# Altium schematic sheet main.SchDoc
size A3
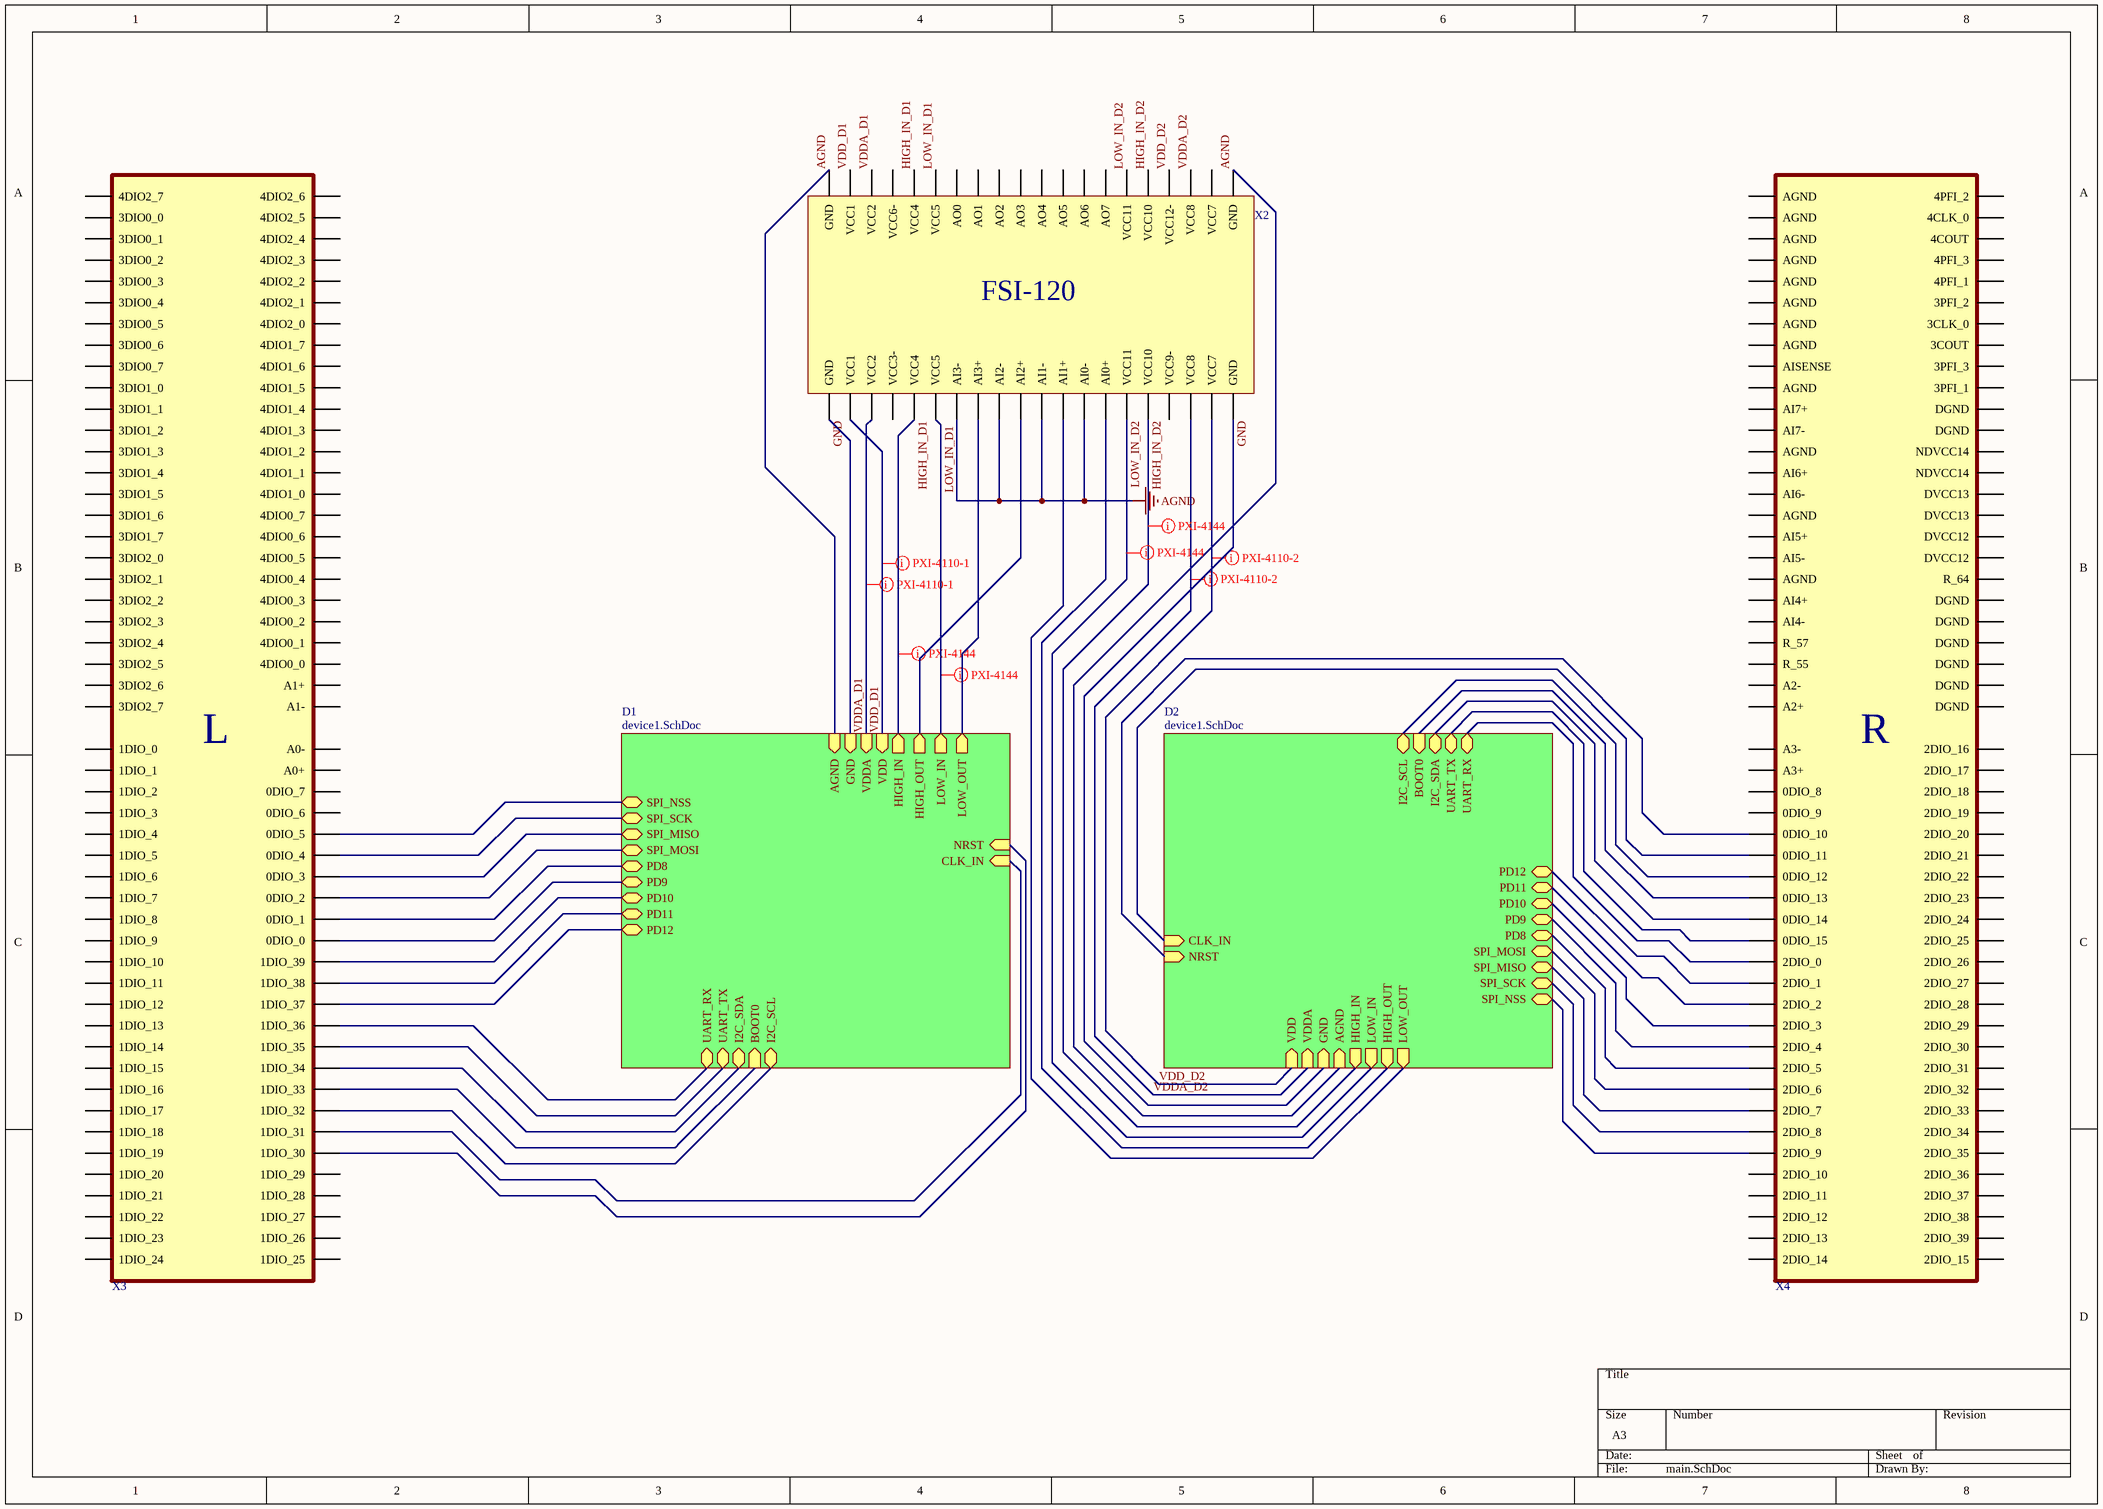
[diagram p0: main.SchDoc]

## Parts
X2  FSI120  [FSI-120]  (value not drawn)
X3  FSI-150-L  [FSI-150]  (value not drawn)
X4  FSI-150-R  [FSI-150]  (value not drawn)

## Sub-sheets
D1 = device1.SchDoc: AGND (in), GND (in), VDDA (in), VDD (in), SPI_NSS (bidir), SPI_SCK (bidir), SPI_MISO (bidir), SPI_MOSI (bidir), PD8 (bidir), PD9 (bidir), PD10 (bidir), PD11 (bidir), PD12 (bidir), UART_RX (bidir), UART_TX (bidir), I2C_SDA (bidir), BOOT0 (in), I2C_SCL (bidir), HIGH_IN (out), LOW_IN (out), NRST (in), CLK_IN (in), HIGH_OUT (out), LOW_OUT (out)
D2 = device1.SchDoc: AGND (in), GND (in), VDDA (in), VDD (in), SPI_NSS (bidir), SPI_SCK (bidir), SPI_MISO (bidir), SPI_MOSI (bidir), PD8 (bidir), PD9 (bidir), PD10 (bidir), PD11 (bidir), PD12 (bidir), UART_RX (bidir), UART_TX (bidir), I2C_SDA (bidir), BOOT0 (in), I2C_SCL (bidir), HIGH_IN (out), LOW_IN (out), NRST (in), CLK_IN (in), LOW_OUT (out), HIGH_OUT (out)

## Nets
AGND: X2.8(AI0-) X2.10(AI1-) X2.12(AI2-) X2.14(AI3-) X2.21(GND) X2.40(GND) ; sheet D1/AGND, sheet D2/AGND
GND: X2.1(GND) X2.20(GND) ; sheet D1/GND, sheet D2/GND
HIGH_IN_D1: X2.16(VCC4) X2.25(VCC4) ; sheet D1/HIGH_IN
HIGH_IN_D2: X2.5(VCC10) X2.36(VCC10) ; sheet D2/HIGH_IN
LOW_IN_D1: X2.15(VCC5) X2.26(VCC5) ; sheet D1/LOW_IN
LOW_IN_D2: X2.6(VCC11) X2.35(VCC11) ; sheet D2/LOW_IN
VDD_D1: X2.19(VCC1) X2.22(VCC1) ; sheet D1/VDD
VDD_D2: X2.2(VCC7) X2.39(VCC12-) ; sheet D2/VDD
VDDA_D1: X2.18(VCC2) X2.23(VCC2) ; sheet D1/VDDA
VDDA_D2: X2.3(VCC8) X2.38(VCC8) ; sheet D2/VDDA
NetX2_7: X2.7(AI0+) ; sheet D2/HIGH_OUT
NetX2_9: X2.9(AI1+) ; sheet D2/LOW_OUT
NetX2_11: X2.11(AI2+) ; sheet D1/HIGH_OUT
NetX2_13: X2.13(AI3+) ; sheet D1/LOW_OUT
NetX3_R_12: X3.R_12(1DIO_30) ; sheet D1/NRST
NetX3_R_14: X3.R_14(1DIO_31) ; sheet D1/CLK_IN
NetX3_R_16: X3.R_16(1DIO_32) ; sheet D1/I2C_SCL
NetX3_R_18: X3.R_18(1DIO_33) ; sheet D1/BOOT0
NetX3_R_20: X3.R_20(1DIO_34) ; sheet D1/I2C_SDA
NetX3_R_22: X3.R_22(1DIO_35) ; sheet D1/UART_TX
NetX3_R_24: X3.R_24(1DIO_36) ; sheet D1/UART_RX
NetX3_R_26: X3.R_26(1DIO_37) ; sheet D1/PD12
NetX3_R_28: X3.R_28(1DIO_38) ; sheet D1/PD11
NetX3_R_30: X3.R_30(1DIO_39) ; sheet D1/PD10
NetX3_R_32: X3.R_32(0DIO_0) ; sheet D1/PD9
NetX3_R_34: X3.R_34(0DIO_1) ; sheet D1/PD8
NetX3_R_36: X3.R_36(0DIO_2) ; sheet D1/SPI_MOSI
NetX3_R_38: X3.R_38(0DIO_3) ; sheet D1/SPI_MISO
NetX3_R_40: X3.R_40(0DIO_4) ; sheet D1/SPI_SCK
NetX3_R_42: X3.R_42(0DIO_5) ; sheet D1/SPI_NSS
NetX4_R_11: X4.R_11(2DIO_9) ; sheet D2/SPI_NSS
NetX4_R_13: X4.R_13(2DIO_8) ; sheet D2/SPI_SCK
NetX4_R_15: X4.R_15(2DIO_7) ; sheet D2/SPI_MISO
NetX4_R_17: X4.R_17(2DIO_6) ; sheet D2/SPI_MOSI
NetX4_R_19: X4.R_19(2DIO_5) ; sheet D2/PD8
NetX4_R_21: X4.R_21(2DIO_4) ; sheet D2/PD9
NetX4_R_23: X4.R_23(2DIO_3) ; sheet D2/PD10
NetX4_R_25: X4.R_25(2DIO_2) ; sheet D2/PD11
NetX4_R_27: X4.R_27(2DIO_1) ; sheet D2/PD12
NetX4_R_29: X4.R_29(2DIO_0) ; sheet D2/UART_RX
NetX4_R_31: X4.R_31(0DIO_15) ; sheet D2/UART_TX
NetX4_R_33: X4.R_33(0DIO_14) ; sheet D2/I2C_SDA
NetX4_R_35: X4.R_35(0DIO_13) ; sheet D2/BOOT0
NetX4_R_37: X4.R_37(0DIO_12) ; sheet D2/I2C_SCL
NetX4_R_39: X4.R_39(0DIO_11) ; sheet D2/CLK_IN
NetX4_R_41: X4.R_41(0DIO_10) ; sheet D2/NRST

Not connected (* = marked no-connect by the designer): X2 4(VCC9-) 17(VCC3-) 24(VCC6-) 27(AO0) 28(AO1) 29(AO2) 30(AO3) 31(AO4) 32(AO5) 33(AO6) 34(AO7) 37(VCC7); X3 R_1(1DIO_24) R_2(1DIO_25) R_3(1DIO_23) R_4(1DIO_26) R_5(1DIO_22) R_6(1DIO_27) R_7(1DIO_21) R_8(1DIO_28) R_9(1DIO_20) R_10(1DIO_29) R_11(1DIO_19) R_13(1DIO_18) R_15(1DIO_17) R_17(1DIO_16) R_19(1DIO_15) R_21(1DIO_14) R_23(1DIO_13) R_25(1DIO_12) R_27(1DIO_11) R_29(1DIO_10) R_31(1DIO_9) R_33(1DIO_8) R_35(1DIO_7) R_37(1DIO_6) R_39(1DIO_5) R_41(1DIO_4) R_43(1DIO_3) R_44(0DIO_6) R_45(1DIO_2) R_46(0DIO_7) R_47(1DIO_1) R_48(A0+) R_49(1DIO_0) R_50(A0-) R_51(3DIO2_7) R_52(A1-) R_53(3DIO2_6) R_54(A1+) R_55(3DIO2_5) R_56(4DIO0_0) R_57(3DIO2_4) R_58(4DIO0_1) R_59(3DIO2_3) R_60(4DIO0_2) R_61(3DIO2_2) R_62(4DIO0_3) R_63(3DIO2_1) R_64(4DIO0_4) R_65(3DIO2_0) R_66(4DIO0_5) R_67(3DIO1_7) R_68(4DIO0_6) R_69(3DIO1_6) R_70(4DIO0_7) R_71(3DIO1_5) R_72(4DIO1_0) R_73(3DIO1_4) R_74(4DIO1_1) R_75(3DIO1_3) R_76(4DIO1_2) R_77(3DIO1_2) R_78(4DIO1_3) R_79(3DIO1_1) R_80(4DIO1_4) R_81(3DIO1_0) R_82(4DIO1_5) R_83(3DIO0_7) R_84(4DIO1_6) R_85(3DIO0_6) R_86(4DIO1_7) R_87(3DIO0_5) R_88(4DIO2_0) R_89(3DIO0_4) R_90(4DIO2_1) R_91(3DIO0_3) R_92(4DIO2_2) R_93(3DIO0_2) R_94(4DIO2_3) R_95(3DIO0_1) R_96(4DIO2_4) R_97(3DIO0_0) R_98(4DIO2_5) R_99(4DIO2_7) R_100(4DIO2_6); X4 R_1(2DIO_14) R_2(2DIO_15) R_3(2DIO_13) R_4(2DIO_39) R_5(2DIO_12) R_6(2DIO_38) R_7(2DIO_11) R_8(2DIO_37) R_9(2DIO_10) R_10(2DIO_36) R_12(2DIO_35) R_14(2DIO_34) R_16(2DIO_33) R_18(2DIO_32) R_20(2DIO_31) R_22(2DIO_30) R_24(2DIO_29) R_26(2DIO_28) R_28(2DIO_27) R_30(2DIO_26) R_32(2DIO_25) R_34(2DIO_24) R_36(2DIO_23) R_38(2DIO_22) R_40(2DIO_21) R_42(2DIO_20) R_43(0DIO_9) R_44(2DIO_19) R_45(0DIO_8) R_46(2DIO_18) R_47(A3+) R_48(2DIO_17) R_49(A3-) R_50(2DIO_16) R_51(A2+) R_52(DGND) R_53(A2-) R_54(DGND) R_55 R_56(DGND) R_57 R_58(DGND) R_59(AI4-) R_60(DGND) R_61(AI4+) R_62(DGND) R_63(AGND) R_64 R_65(AI5-) R_66(DVCC12) R_67(AI5+) R_68(DVCC12) R_69(AGND) R_70(DVCC13) R_71(AI6-) R_72(DVCC13) R_73(AI6+) R_74(NDVCC14) R_75(AGND) R_76(NDVCC14) R_77(AI7-) R_78(DGND) R_79(AI7+) R_80(DGND) R_81(AGND) R_82(3PFI_1) R_83(AISENSE) R_84(3PFI_3) R_85(AGND) R_86(3COUT) R_87(AGND) R_88(3CLK_0) R_89(AGND) R_90(3PFI_2) R_91(AGND) R_92(4PFI_1) R_93(AGND) R_94(4PFI_3) R_95(AGND) R_96(4COUT) R_97(AGND) R_98(4CLK_0) R_99(AGND) R_100(4PFI_2)

## Layout directives
mark named PXI-4110-1: VDD_D1, VDDA_D1
mark named PXI-4110-2: VDD_D2, VDDA_D2
mark named PXI-4144: HIGH_IN_D1, HIGH_IN_D2, LOW_IN_D1, LOW_IN_D2

## Notes on the sheet
- (in symbol FSI120) FSI-120
- (in symbol FSI-150-L) L
- (in symbol FSI-150-R) R

## Library data of the parts
X3 = FSI-150-L: fsi 150 left
X4 = FSI-150-R: fsi 150 right